# EAGLE design board (EAGLE 9.6.2)
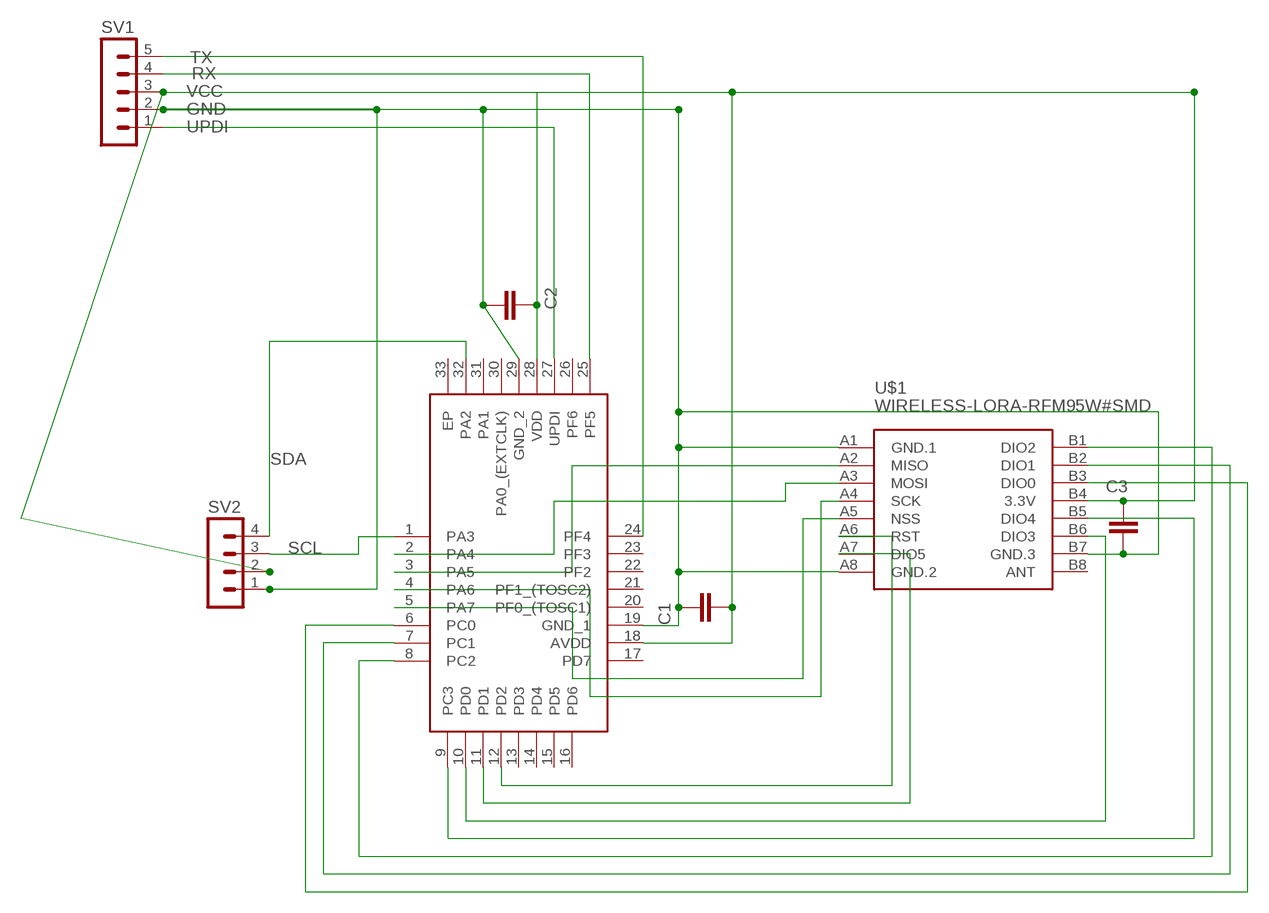
[diagram p0: schematic, sheet 1]

## Parts
C1  CC0805KRX7R9BB104  [CAP_0805]
C2  CC0805KRX7R9BB104  [CAP_0805]
C3  CC0805KRX7R9BB104  [CAP_0805]
IC1  ATMEGA3208-MFR  [QFN50P500X500X90-33N]
SV1  MA05-1  [MA05-1]
SV2  MA04-1  [MA04-1]
U$1  WIRELESS-LORA-RFM95W#SMD  [WIRELESS-LORA-RFM95W#SMD]

## Nets
GND [POWERLINES]: C1.1 C2.2 C3.2 IC1.19(GND_1) IC1.29(GND_2) SV1.2 SV2.1 U$1.A1(GND.1) U$1.A8(GND.2) U$1.B7(GND.3)
N$1: IC1.2(PA4) U$1.A3(MOSI)
N$2: IC1.3(PA5) U$1.A2(MISO)
N$3: IC1.4(PA6) U$1.A4(SCK)
N$4: IC1.5(PA7) U$1.A5(NSS)
N$5: IC1.11(PD1) U$1.A7(DIO5)
N$6: IC1.12(PD2) U$1.A6(RST)
N$11: IC1.6(PC0) U$1.B3(DIO0)
N$12: IC1.7(PC1) U$1.B2(DIO1)
N$13: IC1.8(PC2) U$1.B1(DIO2)
N$14: IC1.9(PC3) U$1.B5(DIO4)
N$15: IC1.10(PD0) U$1.B6(DIO3)
RX: IC1.25(PF5) SV1.4
SCL: IC1.1(PA3) SV2.3
SDA: IC1.32(PA2) SV2.4
TX: IC1.24(PF4) SV1.5
UPDI: IC1.27(UPDI) SV1.1
VCC [POWERLINES]: C1.2 C2.1 C3.1 IC1.18(AVDD) IC1.28(VDD) SV1.3 SV2.2 U$1.B4(3.3V)
Unconnected: IC1.13(PD3) IC1.14(PD4) IC1.15(PD5) IC1.16(PD6) IC1.17(PD7) IC1.20(PF0_(TOSC1)) IC1.21(PF1_(TOSC2)) IC1.22(PF2) IC1.23(PF3) IC1.26(PF6) IC1.30(PA0_(EXTCLK)) IC1.31(PA1) IC1.33(EP) U$1.B8(ANT)

## Library data of the parts
C1-C3 = Resistor_Capacitor:CC0805KRX7R9BB104: CAP CER 0.1UF 50V X7R 0805 Manufacturer's datasheet <http://www.yageo.com/documents/recent/UPY-GPHC_X7R_6.3V-to-50V_18.pdf>; CREATED_BY: PCBLayout.com; DIGIKEY_PART_NUMBER: 311-1140-2-ND; MANUFACTURER: Yageo; MPN: CC0805KRX7R9BB104; PACKAGE: SMD 0805
IC1 = SamacSys_Parts:ATMEGA3208-MFR: Microchip Technology ATmega3208-MFR, 8bit Microcontroller, 20MHz, 32 kB Flash, 32-Pin QFN Source: Datasheet <http://www.microchip.com/filehandler/redirect?http://ww1.microchip.com/downloads/en/DeviceDoc/32-pin-Data-SheetmegaAVR-0-series-DS40002017B.pdf>; DESCRIPTION: Microchip Technology ATmega3208-MFR, 8bit Microcontroller, 20MHz, 32 kB Flash, 32-Pin QFN; HEIGHT: 0.9mm; MANUFACTURER_NAME: Microchip; MANUFACTURER_PART_NUMBER: ATMEGA3208-MFR; MOUSER_PART_NUMBER: 556-ATMEGA3208-MFR; MOUSER_PRICE-STOCK: https://www.mouser.co.uk/ProductDetail/Microchip-Technology-Atmel/ATMEGA3208-MFR?qs=y6ZabgHbY%252BxtjyJ79E4ycg%3D%3D
SV1 = con-lstb:MA05-1: PIN HEADER; OC_FARNELL: unknown; OC_NEWARK: unknown
SV2 = con-lstb:MA04-1: PIN HEADER; OC_FARNELL: unknown; OC_NEWARK: unknown
U$1 = diy-modules:WIRELESS-LORA-RFM95W: 868/915 MHz LoRa Radio Transceiver Module based on SX1276 chip Click here to find device on ebay.com <http://www.ebay.com/sch/RFM95W+transceiver>

## Net classes
1 POWERLINES: width 0.254 mm

## Board
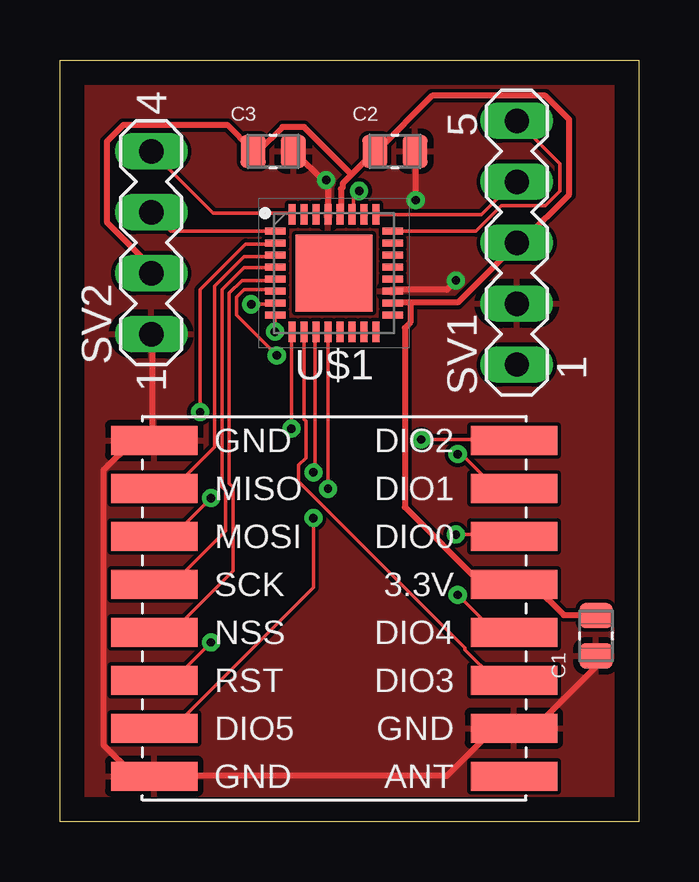
[diagram p1: board, top side]
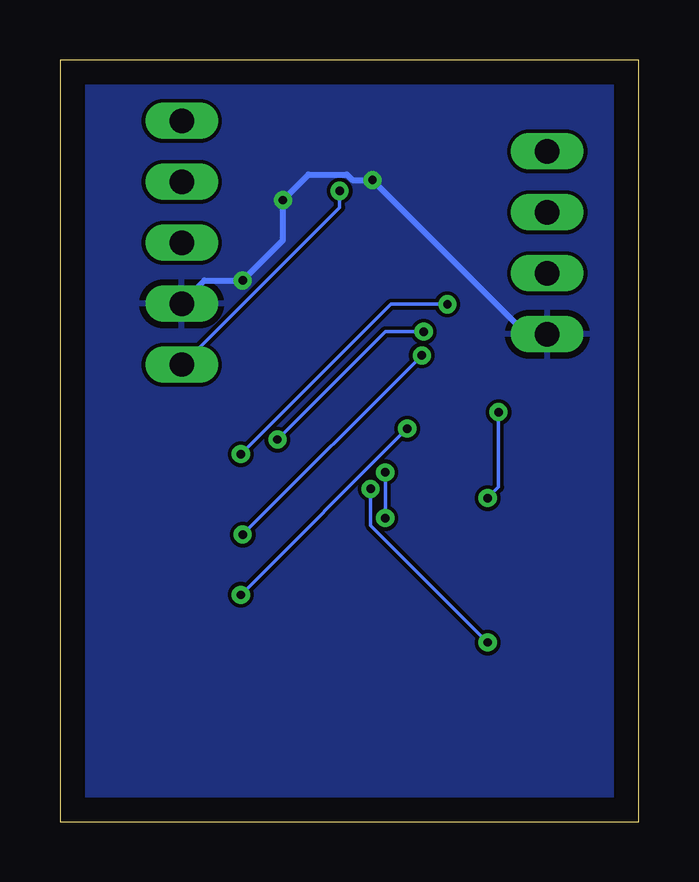
[diagram p2: board, bottom side, seen from below]

Size 24.13 x 31.75 mm. Coordinates in mm from the lower left corner, seen from the top.
Outline: 0,31.75 24.13,31.75 24.13,0 0,0 0,31.75
Copper layers (1*16): Top 0.035mm / dielectric 1.5mm / Bottom 0.035mm
Design rules "default": minimum track width 6mil, minimum drill 0.35mm, track to track 6mil, track to pad 6mil, pad to pad 6mil, via to via 6mil, smd to smd 6mil, copper to edge 40mil, drill to drill 6mil, minimum pad ring 10mil, minimum via ring 8mil, stop-mask expansion 4mil, vias tented up to drill 0mil, thermal gap 10mil

### Footprints (pad centres in the part's own frame; a part is rotated, then mirrored left to right if it is on the bottom)
CAP_0805 = smd 1.05 x 1.38: 1 -0.84,0; 2 0.84,0
QFN50P500X500X90-33N = smd 0.85 x 0.3: 1 -2.45,1.75; 2 -2.45,1.25; 3 -2.45,0.75; 4 -2.45,0.25; 5 -2.45,-0.25; 6 -2.45,-0.75; 7 -2.45,-1.25; 8 -2.45,-1.75; 17 2.45,-1.75; 18 2.45,-1.25; 19 2.45,-0.75; 20 2.45,-0.25; 21 2.45,0.25; 22 2.45,0.75; 23 2.45,1.25; 24 2.45,1.75 | smd 0.3 x 0.85: 9 -1.75,-2.45; 10 -1.25,-2.45; 11 -0.75,-2.45; 12 -0.25,-2.45; 13 0.25,-2.45; 14 0.75,-2.45; 15 1.25,-2.45; 16 1.75,-2.45; 25 1.75,2.45; 26 1.25,2.45; 27 0.75,2.45; 28 0.25,2.45; 29 -0.25,2.45; 30 -0.75,2.45; 31 -1.25,2.45; 32 -1.75,2.45 | smd 3.2 x 3.2: 33 0,0
MA05-1 = drill 1.016 long: 1 -5.08,0; 2 -2.54,0; 3 0,0; 4 2.54,0; 5 5.08,0
MA04-1 = drill 1.016 long: 1 -3.81,0; 2 -1.27,0; 3 1.27,0; 4 3.81,0
WIRELESS-LORA-RFM95W#SMD = smd 3.6 x 1.2: A1 -7.5,7; A2 -7.5,5; A3 -7.5,3; A4 -7.5,1; A5 -7.5,-1; A6 -7.5,-3; A7 -7.5,-5; A8 -7.5,-7; B1 7.5,7; B2 7.5,5; B3 7.5,3; B4 7.5,1; B5 7.5,-1; B6 7.5,-3; B7 7.5,-5; B8 7.5,-7

### Placement (x,y rotation side)
C1  22.35,7.75 90 top
C2  13.97,27.94 0 top
C3  8.89,27.94 0 top
IC1  11.43,22.86 0 top
SV1  19.05,24.13 90 top
SV2  3.81,24.13 90 top
U$1  11.43,8.89 0 top

### Tracks (layer width: path | path; a pad name or v marks a point on that pad's centre or on a via)
GND  (via drill 0.35)
  Top 0.254: C1.1 22.3,6.86 22.3,6.4 19.86,3.96 18.95,3.96 U$1.B7 18.87,3.81 18.03,3.81 16.13,1.91 3.94,1.91 U$1.A8 3.86,1.98 3.02,1.98 1.8,3.2 1.8,14.63 3.02,15.85 3.79,15.85 U$1.A1 3.86,15.93 3.86,20.27 SV2.1 | 11.02,26.67 9.8,27.89 C3.2 | 11.02,26.67 11.18,26.52 11.18,25.38 IC1.29 | v16.51,22.55 16.13,22.17 13.92,22.17 IC1.19 | v14.83,25.91 14.83,27.89 C2.2 | v11.1,26.75 11.02,26.67
  Bottom 0.254: SV1.2 19.02,21.64 18.11,22.55 v16.51,22.55 14.83,24.23 v14.83,25.91 13.77,26.98 12.17,26.98 11.94,26.75 v11.1,26.75 4.7,20.34 3.86,20.34 SV2.1
  pour Top (isolate 0): 0,33.02 25.4,33.02 25.4,-1.27 -1.27,-1.27 -1.27,33.02
  pour Bottom (isolate 0): -2.54,34.29 26.67,34.29 26.67,-2.54 -2.54,-2.54
N$1  (via drill 0.35)
  Top 0.152: v5.84,17.07 5.84,22.17 7.75,24.08 8.97,24.08 IC1.2 | v6.3,13.49 4.77,11.96 3.94,11.96 U$1.A3
  Bottom 0.152: v5.84,17.07 5.84,13.95 v6.3,13.49
N$2
  Top 0.152: IC1.3 8.97,23.55 7.67,23.55 6.45,22.33 6.45,15.62 4.77,13.95 3.94,13.95 U$1.A2
N$3
  Top 0.152: IC1.4 8.97,23.09 7.67,23.09 6.76,22.17 6.76,13.95 6.91,13.79 6.91,12.12 4.7,9.91 3.94,9.91 U$1.A4
N$4
  Top 0.152: IC1.5 8.97,22.55 7.59,22.55 7.06,22.02 7.06,14.1 7.21,13.95 7.21,10.44 4.7,7.93 3.94,7.93 U$1.A5
N$5  (via drill 0.35)
  Top 0.152: v10.57,14.55 10.64,14.63 10.64,20.34 IC1.11 | v10.57,12.65 10.57,9.75 4.77,3.96 3.94,3.96 U$1.A7
  Bottom 0.152: v10.57,12.65 v10.57,14.55
N$6  (via drill 0.35)
  Top 0.152: v11.18,13.87 11.18,20.34 IC1.12 | v6.3,7.47 4.77,5.94 3.94,5.94 U$1.A6
  Bottom 0.152: v11.18,13.87 11.18,12.34 v6.3,7.47
N$11  (via drill 0.35)
  Top 0.152: v9.04,19.43 7.37,21.11 7.37,21.87 7.67,22.17 8.97,22.17 IC1.6 | v16.51,11.96 18.87,11.96 U$1.B3
  Bottom 0.152: v16.51,11.96 v9.04,19.43
N$12  (via drill 0.35)
  Top 0.152: v7.98,21.56 8.97,21.56 IC1.7 | v16.59,15.32 16.74,15.32 18.11,13.95 18.87,13.95 U$1.B2
  Bottom 0.152: v7.98,21.56 10.34,21.56 v16.59,15.32
N$13  (via drill 0.35)
  Top 0.152: v8.97,20.42 8.97,21.11 IC1.8 | v15.06,15.93 18.87,15.93 U$1.B1
  Bottom 0.152: v8.97,20.42 10.57,20.42 v15.06,15.93
N$14  (via drill 0.35)
  Top 0.152: v9.65,16.38 9.65,20.34 IC1.9 | v16.59,9.45 18.11,7.93 18.87,7.93 U$1.B5
  Bottom 0.152: v16.59,9.45 v9.65,16.38
N$15
  Top 0.152: IC1.10 10.18,20.34 10.18,16.76 10.26,16.69 10.26,15.16 9.96,14.86 9.96,14.17 16.89,7.24 16.89,7.16 18.11,5.94 18.87,5.94 U$1.B6
RX
  Top 0.152: SV1.4 18.95,26.67 17.58,25.3 13.23,25.3 IC1.25
SCL
  Top 0.152: IC1.1 8.97,24.61 4.62,24.61 3.86,25.38 SV2.3
SDA
  Top 0.152: SV2.4 6.38,25.38 9.65,25.38 IC1.32
TX
  Top 0.152: IC1.24 13.92,24.61 17.35,24.61 18.41,25.68 20.24,25.68 20.85,26.29 20.85,27.43 19.1,29.19 SV1.5
UPDI  (via drill 0.35)
  Top 0.152: v12.47,26.29 12.24,26.06 12.24,25.38 IC1.27
  Bottom 0.152: v12.47,26.29 12.47,25.6 19.02,19.05 SV1.1
VCC
  Top 0.254: 12.17,26.98 13.08,27.89 C2.1 13.23,27.97 15.52,30.25 20.24,30.25 21.23,29.26 21.23,26.14 19.33,24.23 19.1,24.23 SV1.3 19.02,24.08 16.59,21.64 14.6,21.64 | 12.17,26.98 11.79,26.59 11.79,26.44 11.71,26.37 11.71,25.38 IC1.28 | 12.17,26.98 10.18,28.96 9.27,28.96 8.28,27.97 8.05,27.97 C3.1 7.98,28.04 6.98,29.03 2.64,29.03 1.96,28.35 1.96,24.99 3.79,23.16 3.79,22.86 SV2.2 | C1.2 22.3,8.61 21.01,8.61 19.79,9.83 18.95,9.83 U$1.B4 18.8,9.91 17.58,9.91 14.38,13.11 14.38,20.57 14.6,20.8 14.6,21.64 | 14.6,21.64 13.92,21.64 IC1.18